# EAGLE design RelayBoard-Large-v11 (EAGLE 5.01)
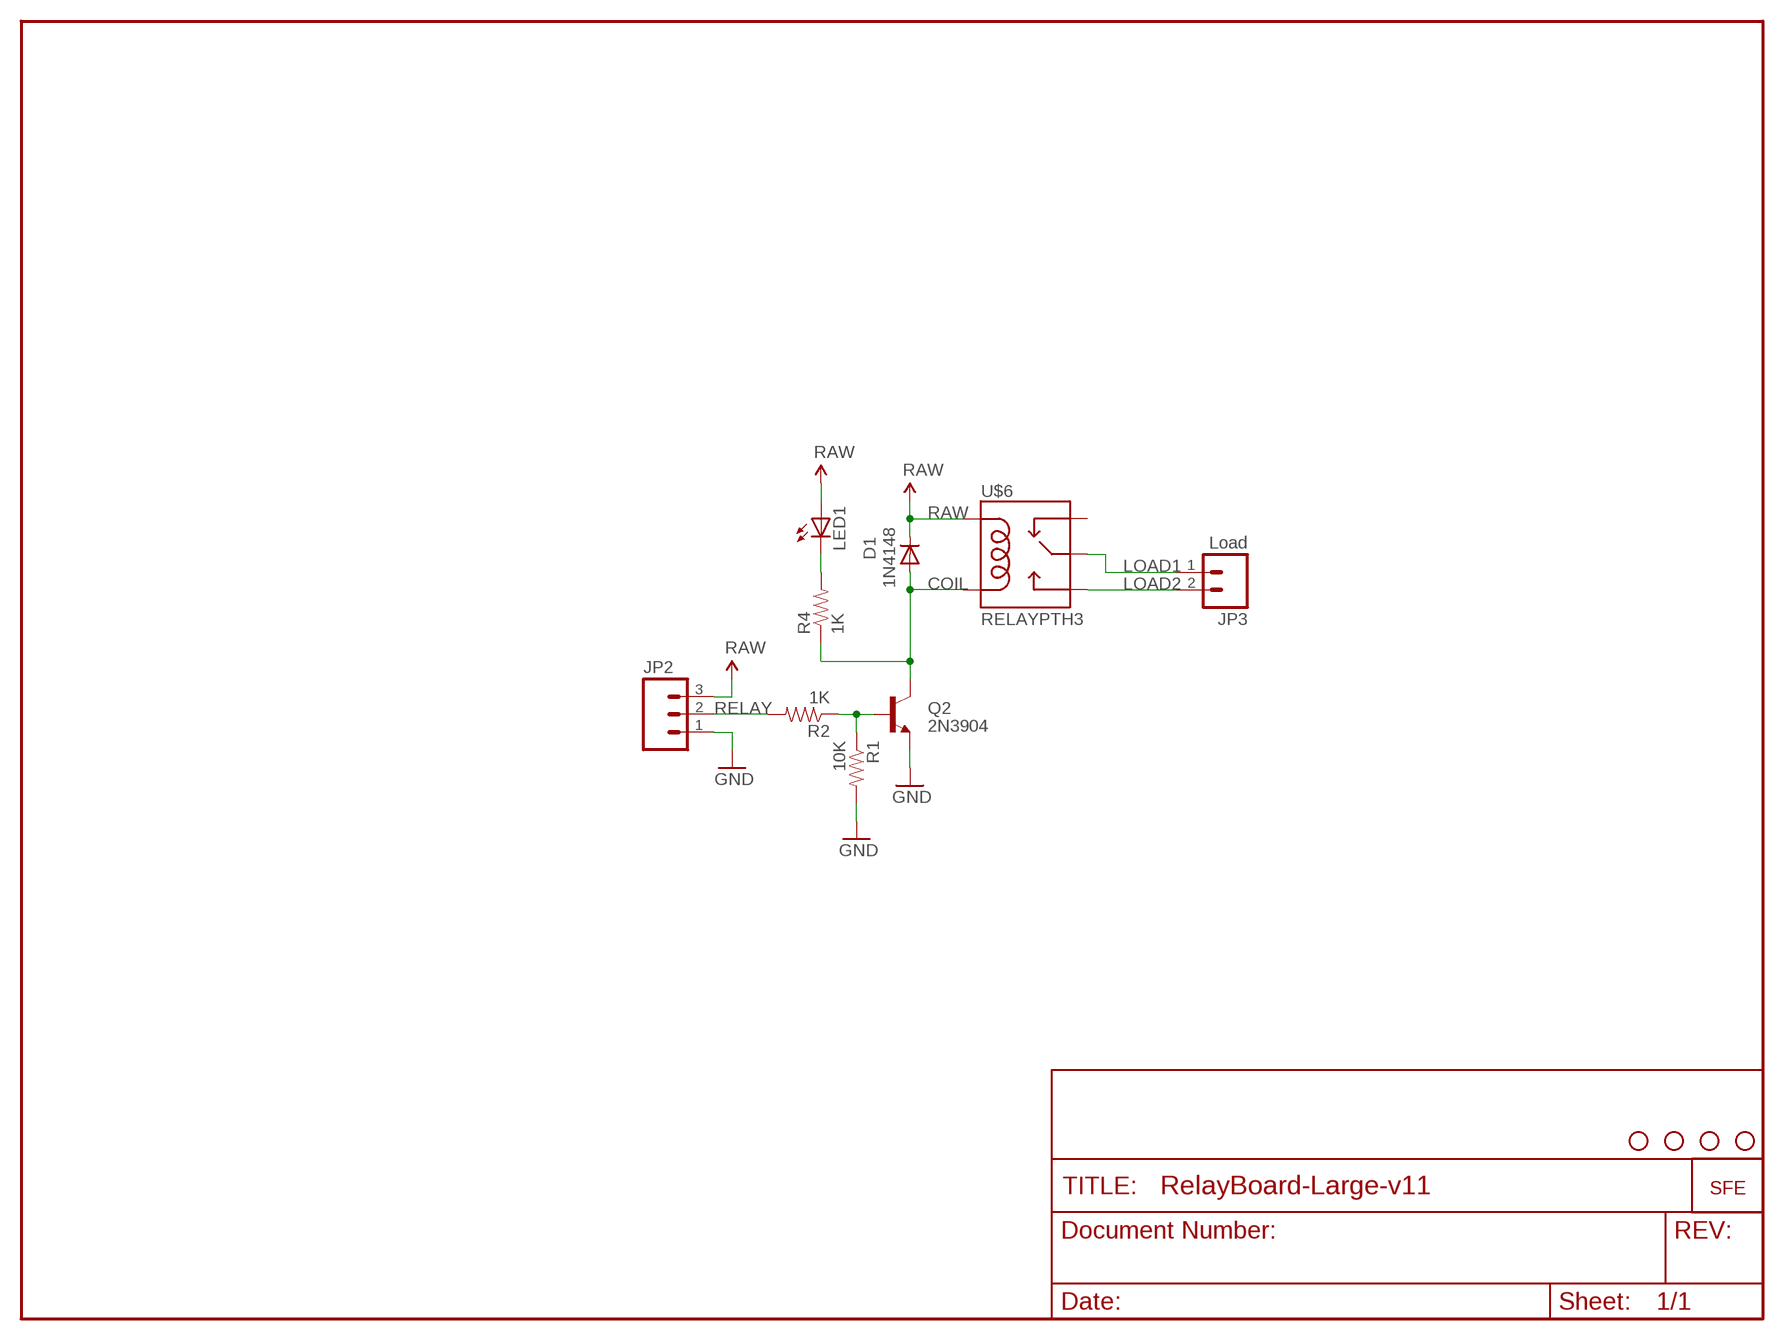
[diagram p0: schematic, sheet 1]

## Parts
D1  1N4148  DIODE1N4148  [DIODE-1N4148]
JP2  M03SCREW  [SCREWTERMINAL-3.5MM-3]
JP3  Load  M025MM  [SCREWTERMINAL-5MM-2]
LED1  LED5MM  [LED5MM]
Q2  2N3904  TRANSISTOR_NPNTO92  [TO-92]
R1  10K  RESISTORPTH1  [AXIAL-0.3]
R2  1K  RESISTORPTH1  [AXIAL-0.3]
R4  1K  RESISTORPTH1  [AXIAL-0.3]
U$1  LOGO-SFENEW  [SFE-NEW-WEBLOGO]
U$3  STAND-OFF  [STAND-OFF]
U$4  STAND-OFF  [STAND-OFF]
U$5  STAND-OFF  [STAND-OFF]
U$6  RELAYPTH3  [RELAY-T9A-2]
U$7  STAND-OFF  [STAND-OFF]

## Nets
COIL: D1.A Q2.3(C) R4.P$1 U$6.COIL2
GND: JP2.1 Q2.1(E) R1.P$2
LOAD1: JP3.1 U$6.MAIN
LOAD2: JP3.2 U$6.NO
N$6: Q2.2(B) R1.P$1 R2.P$1
N$9: LED1.K(C) R4.P$2
RAW: D1.C JP2.3 LED1.A U$6.COIL1
RELAY: JP2.2 R2.P$2
Unconnected: U$6.NC

## Library data of the parts
D1 = SparkFun:DIODE: Diode These are standard reverse protection diodes and small signal diodes. SMA package can handle up to about 1A. SOD-323 can handle about 200mA. What the SOD-323 package when ordering, there are some mfgs out there that are 5-pin packages.
JP2 = SparkFun:M03: Header 3 Standard 3-pin 0.1" header. Use with straight break away headers (SKU : PRT-00116), right angle break away headers (PRT-00553), swiss pins (PRT-00743), machine pins (PRT-00117), and female headers (PRT-00115). Molex polarized connector foot print use with SKU : PRT-08232 with associated crimp pins and housings.
JP3 = SparkFun:M02: Header 2 Standard 2-pin 0.1" header. Use with straight break away headers (SKU : PRT-00116), right angle break away headers (PRT-00553), swiss pins (PRT-00743), machine pins (PRT-00117), and female headers (PRT-00115). Molex polarized connector foot print use with SKU : PRT-08233 with associated crimp pins and housings.
LED1 = SparkFun:LED: LEDs Standard schematic elements and footprints for 5mm, 3mm, 1206, and 0603 sized LEDs. 5mm - Spark Fun Electronics SKU : COM-00529 (and others)
Q2 = SparkFun:TRANSISTOR_NPN: Transistor NPN BJT configuration in SOT23 package. MMBT2222 is the common NPN we use. Double check BCE configuration again layout.
R1 R2 R4 = SparkFun:RESISTOR: Resistor Basic schematic elements and footprints for 0603, 1206, and PTH 1/10th watt (small) resistors.
U$1 = SparkFun:LOGO-SFE: Spark Fun Electronics PCB Logo This is the standard Spark Fun Electronics PCB logo.
U$3-U$5 U$7 = SparkFun:STAND-OFF: Stand Off This is the mechanical footprint for a #4 phillips button head screw. Use the keepout ring to avoid running the screw head into surrounding components. SKU : PRT-00447
U$6 = SparkFun:RELAY

## Board
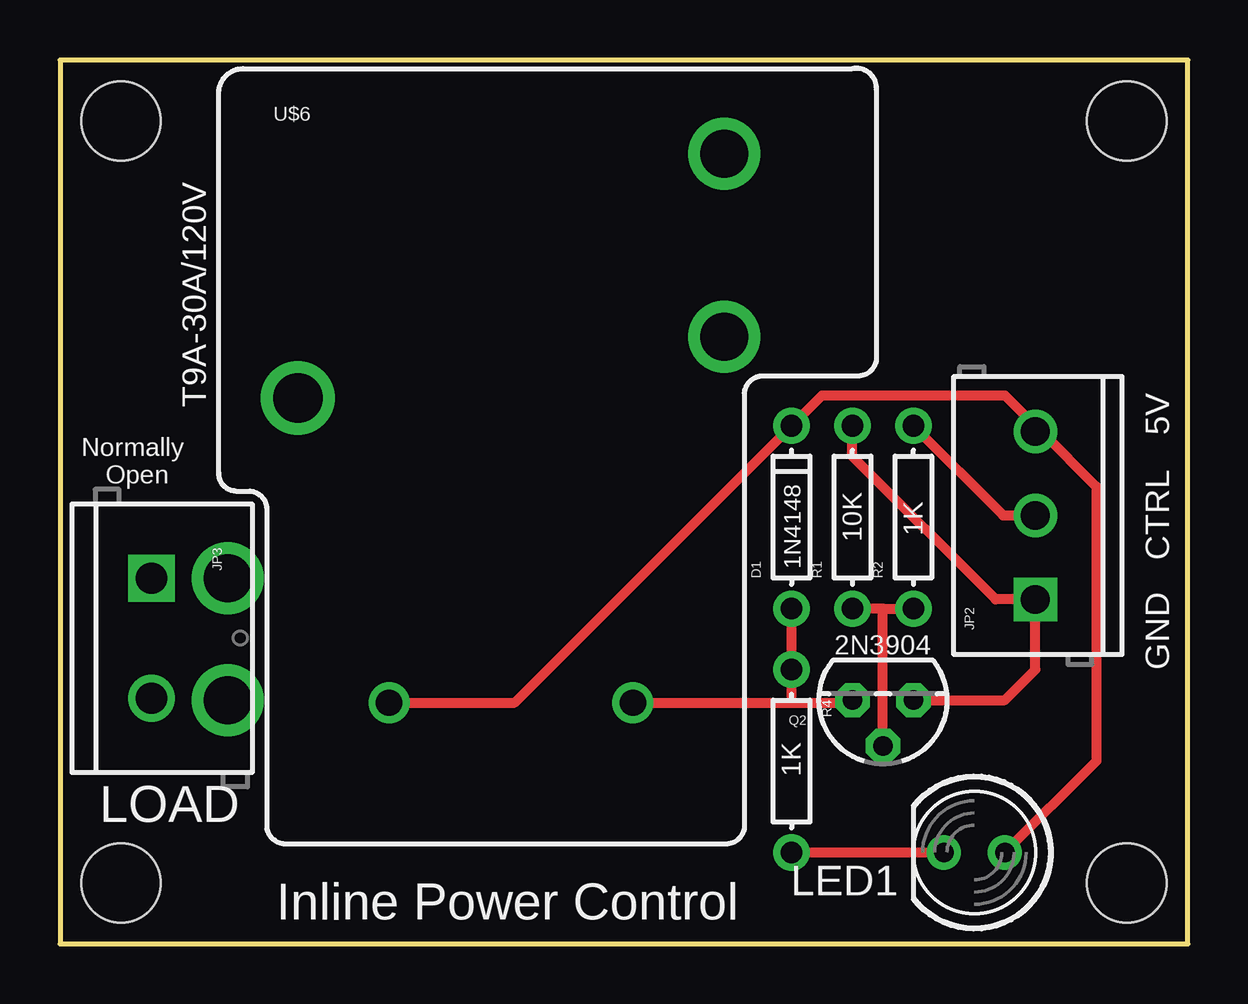
[diagram p1: board, top side]
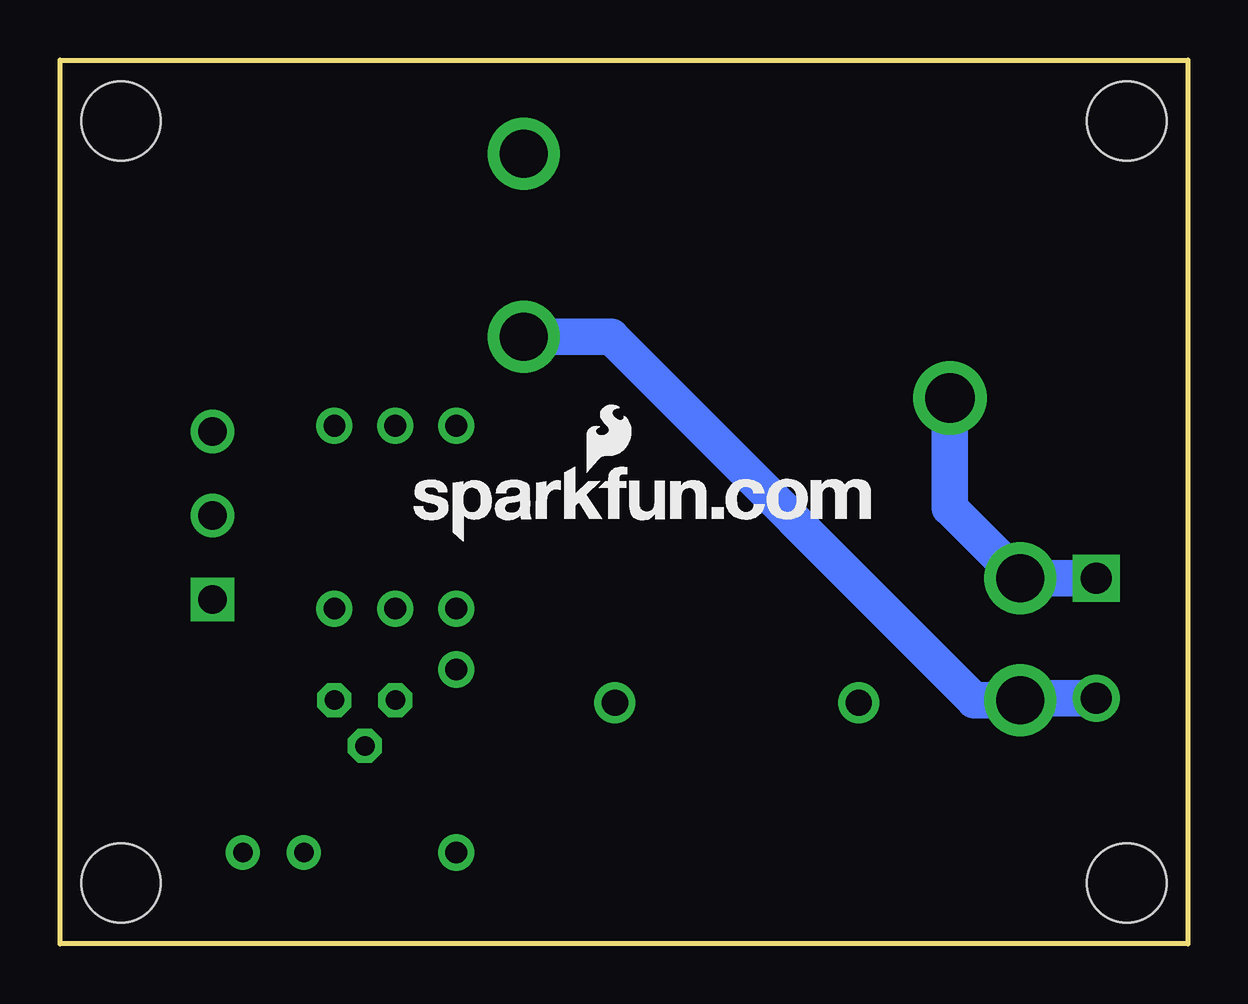
[diagram p2: board, bottom side, seen from below]

Size 46.99 x 36.83 mm. Coordinates in mm from the lower left corner, seen from the top.
Outline: 0,0 46.99,0 46.99,36.83 0,36.83 0,0
Copper layers (1*16): Top 0.035mm / dielectric 1.5mm / Bottom 0.035mm
Design rules "SparkFun *": minimum track width 16mil, minimum drill 20mil, track to track 8mil, track to pad 8mil, pad to pad 8mil, via to via 8mil, smd to smd 8mil, copper to edge 10mil, drill to drill 8mil, minimum pad ring 12mil, minimum via ring 10mil, stop-mask expansion 4mil, vias tented up to drill 20mil, thermal gap 10mil

### Footprints (pad centres in the part's own frame; a part is rotated, then mirrored left to right if it is on the bottom)
DIODE-1N4148 = drill 0.9 round: A -3.81,0; C 3.81,0
SCREWTERMINAL-3.5MM-3 = drill 1.2 square: 1 0,0 | drill 1.2 round: 2 3.5,0; 3 7,0
SCREWTERMINAL-5MM-2 = drill 1.3 square: 1 0,0 | drill 1.3 round: 2 5,0
LED5MM = drill 0.813 round: A -1.27,0; K 1.27,0
TO-92 = drill 0.813 octagon: 1 -1.27,0; 2 0,1.905; 3 1.27,0
AXIAL-0.3 = drill 0.9 round: P$1 -3.81,0; P$2 3.81,0
STAND-OFF = hole 3.302: 0,0
RELAY-T9A-2 = drill 1.1 round: COIL1 -6.61,-10.27; COIL2 3.55,-10.27 | drill 2.057 round: MAIN -10.41,2.43 | drill 2 round: NC 7.35,12.6; NO 7.35,4.97

### Placement (x,y rotation side)
D1  30.48,17.78 90 top
JP2  40.64,14.35 90 top
JP3  3.81,15.24 270 top
LED1  38.1,3.81 180 top
Q2  34.29,10.16 180 top
R1  33.02,17.78 90 top
R2  35.56,17.78 90 top
R4  30.48,7.62 270 top
U$1  32.26,16.76 0 bottom
U$3  2.54,2.54 0 top
U$4  44.45,2.54 0 top
U$5  44.45,34.29 0 top
U$6  20.32,20.32 0 top
U$7  2.54,34.29 0 top

### Tracks (layer width: path | path; a pad name or v marks a point on that pad's centre or on a via)
COIL
  Top 0.406: U$6.COIL2 30.48,10.05 | D1.A R4.P$1 30.48,10.05 | 30.48,10.05 32.91,10.05 Q2.3
GND
  Top 0.406: Q2.1 39.37,10.16 40.64,11.43 JP2.1 38.99,14.35 33.02,20.32 R1.P$2
LOAD1  (via drill 2)
  Bottom 1.524: U$6.MAIN 9.91,18.16 v6.99,15.24 | v6.99,15.24 7.11,15.24 | JP3.1 v6.99,15.24
LOAD2  (via drill 2)
  Bottom 1.524: U$6.NO 24.02,25.29 8.89,10.16 v6.99,10.16 6.99,10.29 6.94,10.24 JP3.2
N$6
  Top 0.406: 34.29,13.97 R1.P$1 | 34.29,13.97 R2.P$1 | Q2.2 34.29,13.97
N$9
  Top 0.406: R4.P$2 LED1.K
RAW
  Top 0.406: LED1.A 43.18,7.62 43.18,19.05 40.88,21.35 JP2.3 40.64,21.59 39.37,22.86 31.75,22.86 D1.C 18.94,10.05 U$6.COIL1
RELAY
  Top 0.406: JP2.2 39.3,17.85 R2.P$2

### Text on the board
tPlace: T9A-30A/120V | 5V | Normally | Open | CTRL | GND | LOAD | Inline Power Control